# Altium project Main.PrjPcb
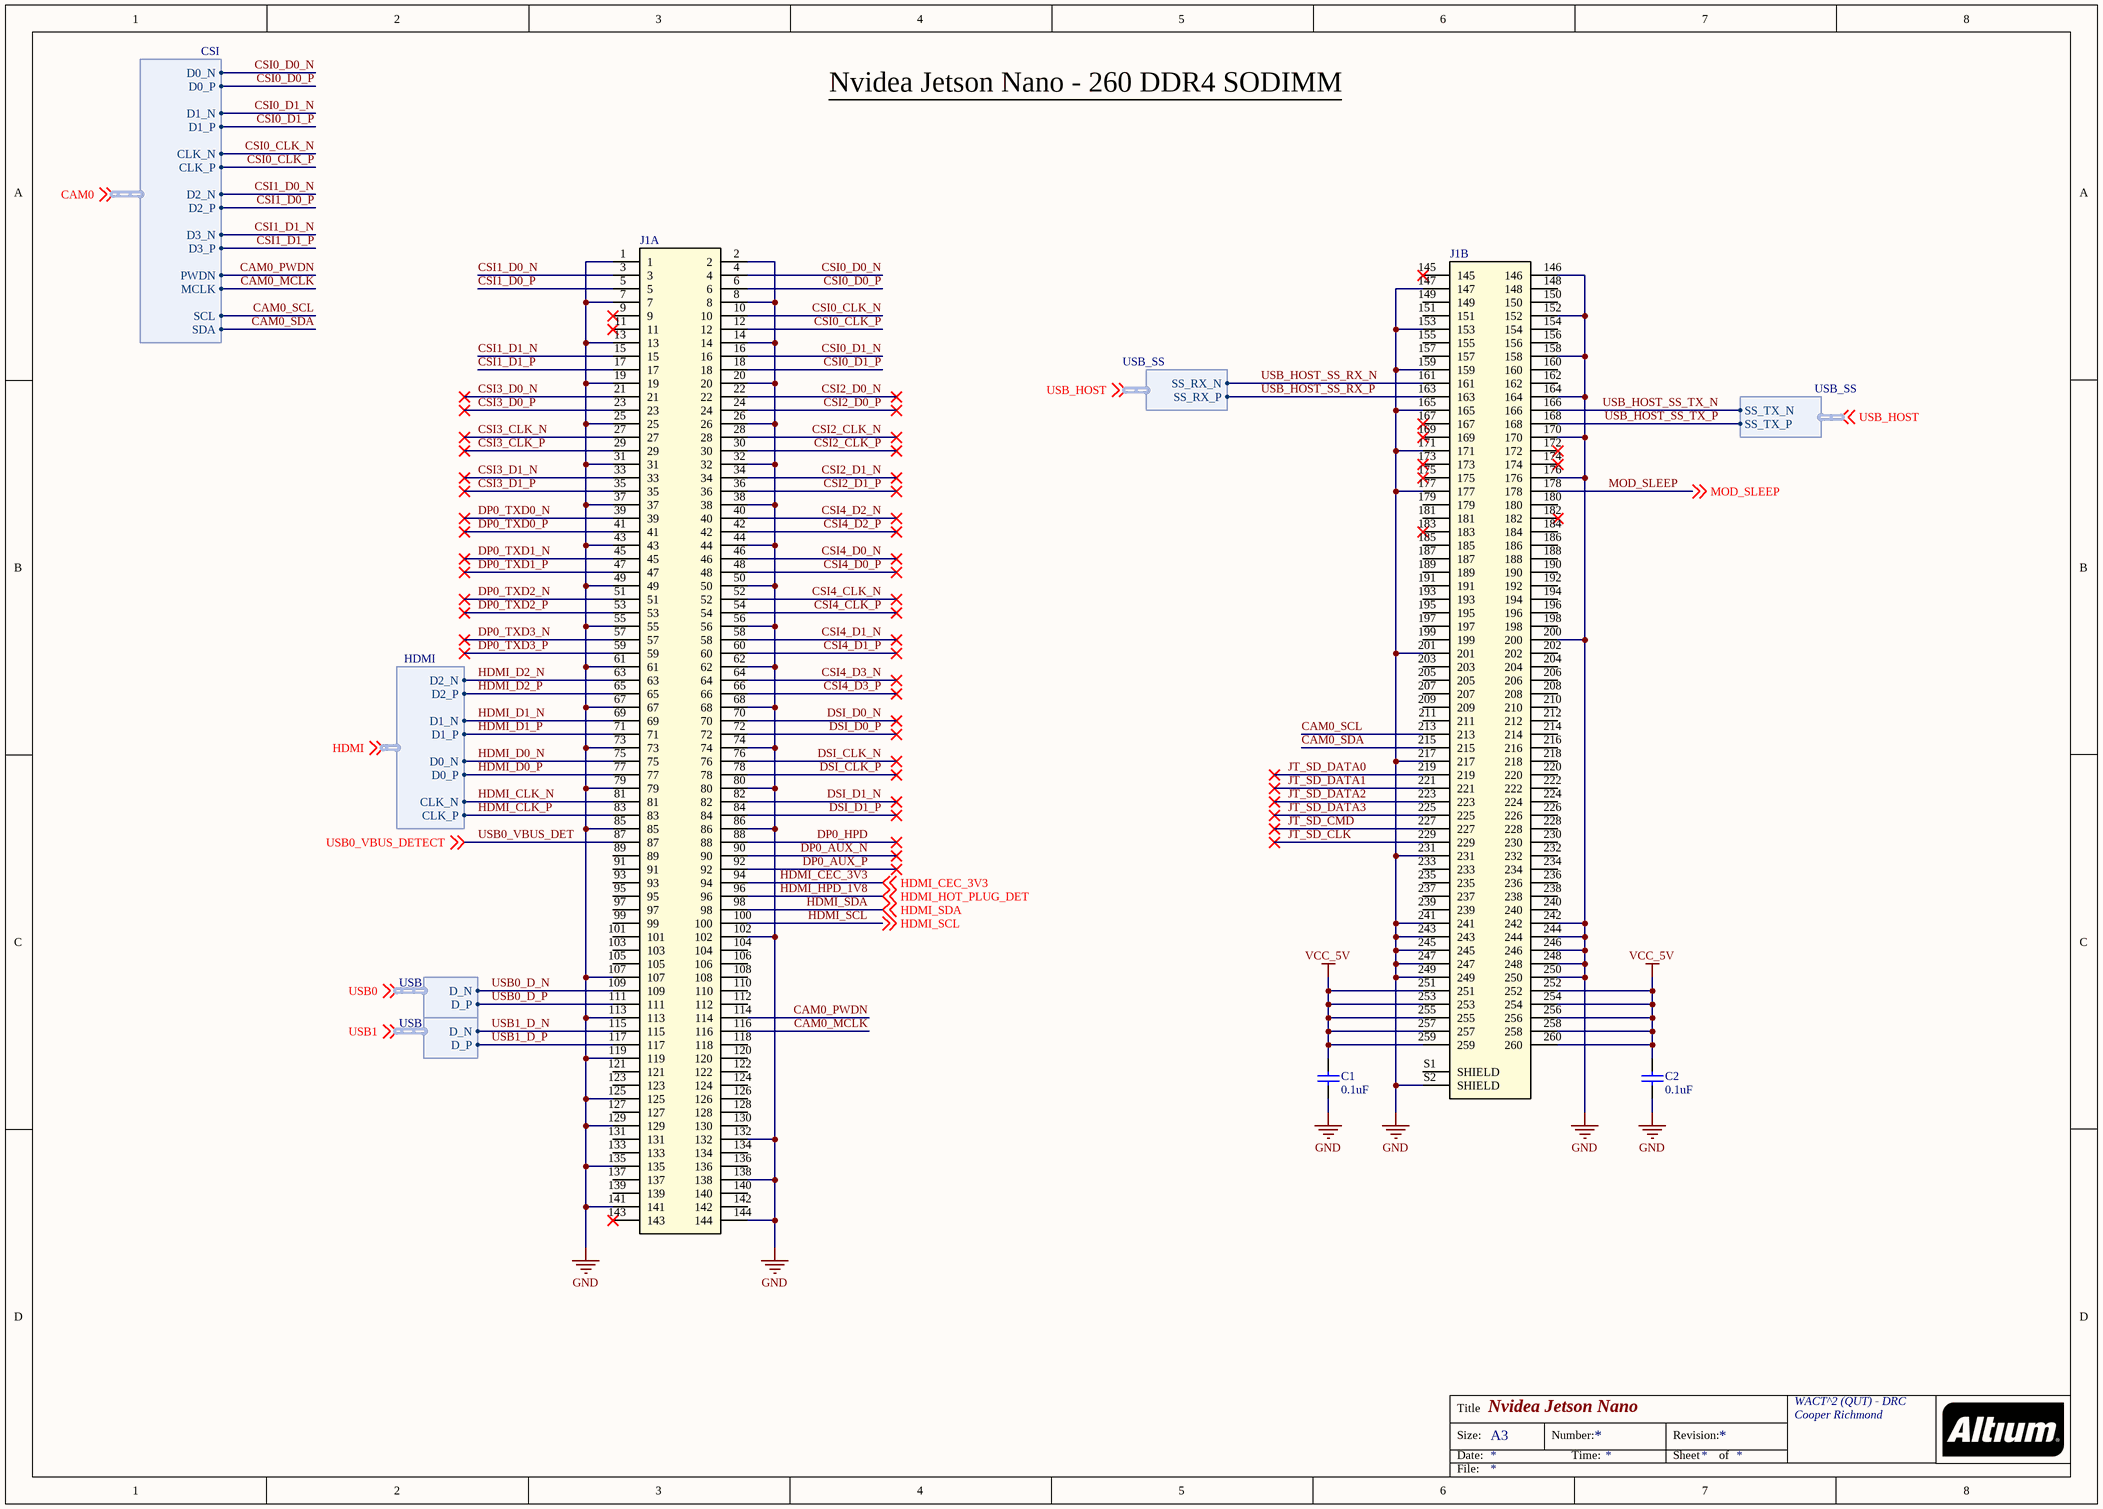
[diagram p0: NvideaJetsonNano.SchDoc]
5 sheets, 165 parts. Net scope: flat (ports and power ports of the same name join across sheets).
Board file: Main.PcbDoc
Sheets:
  NvideaJetsonNano.SchDoc
  NvideaJetsonPeripherals.SchDoc
  PowerSupply.SchDoc
  NvideaJetsonUSB.SchDoc
  NvideaJetsonUSBPage2.SchDoc

## Sheet NvideaJetsonNano.SchDoc: Nvidea Jetson Nano
size A3; Author: Cooper Richmond; DrawnBy: Cooper Richmond; Organization: WACT^2 (QUT) - DRC; Address1: Cooper Richmond

### Parts
C1  value 0.1uF  [C0402]  (hidden comment: CAP)
C2  value 0.1uF  [C0402]  (hidden comment: CAP)
J1  2309411-2  [TE_2309411]  (value not drawn)  (parts A,B of 2)

### Harnesses
USB: D_N, D_P
HDMI: D2_N, D2_P, D1_N, D1_P, D0_N, D0_P, CLK_N, CLK_P
CSI: D0_N, D0_P, D1_N, D1_P, CLK_N, CLK_P, D2_N, D2_P, D3_N, D3_P, PWDN, MCLK, SCL, SDA
USB_SS: SS_RX_P, SS_RX_N
USB_SS: SS_TX_N, SS_TX_P

### Nets
GND: C1.2 C2.2 J1.1 J1.2 J1.7 J1.8 J1.13 J1.14 J1.19 J1.20 J1.25 J1.26 J1.31 J1.32 J1.37 J1.38 J1.43 J1.44 J1.49 J1.50 J1.55 J1.56 J1.61 J1.62 J1.67 J1.68 J1.73 J1.74 J1.79 J1.80 J1.85 J1.86 J1.102 J1.107 J1.113 J1.119 J1.125 J1.129 J1.132 J1.135 J1.138 J1.141 J1.144 J1.146 J1.147 J1.152 J1.153 J1.158 J1.159 J1.164 J1.165 J1.170 J1.171 J1.176 J1.177 J1.200 J1.201 J1.217 J1.231 J1.241 J1.242 J1.243 J1.244 J1.245 J1.246 J1.247 J1.248 J1.249 J1.250 J1.S2(SHIELD)
VCC_5V: C1.1 C2.1 J1.251 J1.252 J1.253 J1.254 J1.255 J1.256 J1.257 J1.258 J1.259 J1.260
CAM0_MCLK: J1.116 ; harness CSI.MCLK
CAM0_PWDN: J1.114 ; harness CSI.PWDN
CAM0_SCL: J1.213 ; harness CSI.SCL
CAM0_SDA: J1.215 ; harness CSI.SDA
CSI0_CLK_N: J1.10 ; harness CSI.CLK_N
CSI0_CLK_P: J1.12 ; harness CSI.CLK_P
CSI0_D0_N: J1.4 ; harness CSI.D0_N
CSI0_D0_P: J1.6 ; harness CSI.D0_P
CSI0_D1_N: J1.16 ; harness CSI.D1_N
CSI0_D1_P: J1.18 ; harness CSI.D1_P
CSI1_D0_N: J1.3 ; harness CSI.D2_N
CSI1_D0_P: J1.5 ; harness CSI.D2_P
CSI1_D1_N: J1.15 ; harness CSI.D3_N
CSI1_D1_P: J1.17 ; harness CSI.D3_P
CSI2_CLK_N: J1.28
CSI2_CLK_P: J1.30
CSI2_D0_N: J1.22
CSI2_D0_P: J1.24
CSI2_D1_N: J1.34
CSI2_D1_P: J1.36
CSI3_CLK_N: J1.27
CSI3_CLK_P: J1.29
CSI3_D0_N: J1.21
CSI3_D0_P: J1.23
CSI3_D1_N: J1.33
CSI3_D1_P: J1.35
CSI4_CLK_N: J1.52
CSI4_CLK_P: J1.54
CSI4_D0_N: J1.46
CSI4_D0_P: J1.48
CSI4_D1_N: J1.58
CSI4_D1_P: J1.60
CSI4_D2_N: J1.40
CSI4_D2_P: J1.42
CSI4_D3_N: J1.64
CSI4_D3_P: J1.66
DP0_AUX_N: J1.90
DP0_AUX_P: J1.92
DP0_HPD: J1.88
DP0_TXD0_N: J1.39
DP0_TXD0_P: J1.41
DP0_TXD1_N: J1.45
DP0_TXD1_P: J1.47
DP0_TXD2_N: J1.51
DP0_TXD2_P: J1.53
DP0_TXD3_N: J1.57
DP0_TXD3_P: J1.59
DSI_CLK_N: J1.76
DSI_CLK_P: J1.78
DSI_D0_N: J1.70
DSI_D0_P: J1.72
DSI_D1_N: J1.82
DSI_D1_P: J1.84
HDMI_CEC_3V3: J1.94 ; off-sheet HDMI_CEC_3V3
HDMI_CLK_N: J1.81 ; harness HDMI.CLK_N
HDMI_CLK_P: J1.83 ; harness HDMI.CLK_P
HDMI_D0_N: J1.75 ; harness HDMI.D0_N
HDMI_D0_P: J1.77 ; harness HDMI.D0_P
HDMI_D1_N: J1.69 ; harness HDMI.D1_N
HDMI_D1_P: J1.71 ; harness HDMI.D1_P
HDMI_D2_N: J1.63 ; harness HDMI.D2_N
HDMI_D2_P: J1.65 ; harness HDMI.D2_P
HDMI_HPD_1V8: J1.96 ; off-sheet HDMI_HOT_PLUG_DET  [also labelled HDMI_HOT_PLUG_DET]
HDMI_SCL: J1.100 ; off-sheet HDMI_SCL
HDMI_SDA: J1.98 ; off-sheet HDMI_SDA
JT_SD_CLK: J1.229
JT_SD_CMD: J1.227
JT_SD_DATA0: J1.219
JT_SD_DATA1: J1.221
JT_SD_DATA2: J1.223
JT_SD_DATA3: J1.225
MOD_SLEEP: J1.178 ; off-sheet MOD_SLEEP
USB0_D_N: J1.109 ; harness USB.D_N
USB0_D_P: J1.111 ; harness USB.D_P
USB0_VBUS_DET: J1.87 ; off-sheet USB0_VBUS_DETECT  [also labelled USB0_VBUS_DETECT]
USB1_D_N: J1.115 ; harness USB.D_N
USB1_D_P: J1.117 ; harness USB.D_P
USB_HOST_SS_RX_N: J1.161 ; harness USB_SS.SS_RX_N
USB_HOST_SS_RX_P: J1.163 ; harness USB_SS.SS_RX_P
USB_HOST_SS_TX_N: J1.166 ; harness USB_SS.SS_TX_N
USB_HOST_SS_TX_P: J1.168 ; harness USB_SS.SS_TX_P

Not connected (* = marked no-connect by the designer): J1 9* 11* 89 91 93 95 97 99 101 103 104 105 106 108 110 112 118 120 121 122 123 124 126 127 128 130 131 133 134 136 137 139 140 142 143* 145* 148 149 150 151 154 155 156 157 160 162 167* 169* 172* 173* 174* 175* 179 180 181 182* 183* 184 185 186 187 188 189 190 191 192 193 194 195 196 197 198 199 202 203 204 205 206 207 208 209 210 211 212 214 216 218 220 222 224 226 228 230 232 233 234 235 236 237 238 239 240 S1(SHIELD)

### Notes on the sheet
- Nvidea Jetson Nano - 260 DDR4 SODIMM
- Labels drawn without touching a wire or pin: CAM0, HDMI, USB0, USB1, USB_HOST
- Title
- Size:
- Date:
- A3
- Number:
- Time:
- Revision:
- Sheet
- of
- File:

### Library data of the parts
C1 C2 = CAP: =Description
J1 = 2309411-2: DDR4 SODIMM 260P 8.0H STD; Centerline_Pitch: .5 mm[.0197 in]; Number_of_Positions: 260; MF: TE Connectivity; Product_Type: Socket; MP: 2309411-2; SnapEDA_Link: https://www.snapeda.com/parts/2309411-2/TE%20Connectivity/view-part/?ref=snap; TE_purchase_URL: https://www.te.com/usa-en/product-2309411-2.html?te_bu=Cor&te_type=disp&te_campaign=seda_glo_cor-seda-global-disp-prtnr-fy19-seda-model-bom-cta_sma-317_1&elqCampaignId=32493; Package: None; EU_RoHS_Compliance: Compliant; Price: None; Value: *

## Sheet NvideaJetsonPeripherals.SchDoc: Nvidea Jetson Peripherals
size A3; Organization: WACT^2 (QUT) - DRC; Address1: Cooper Richmond
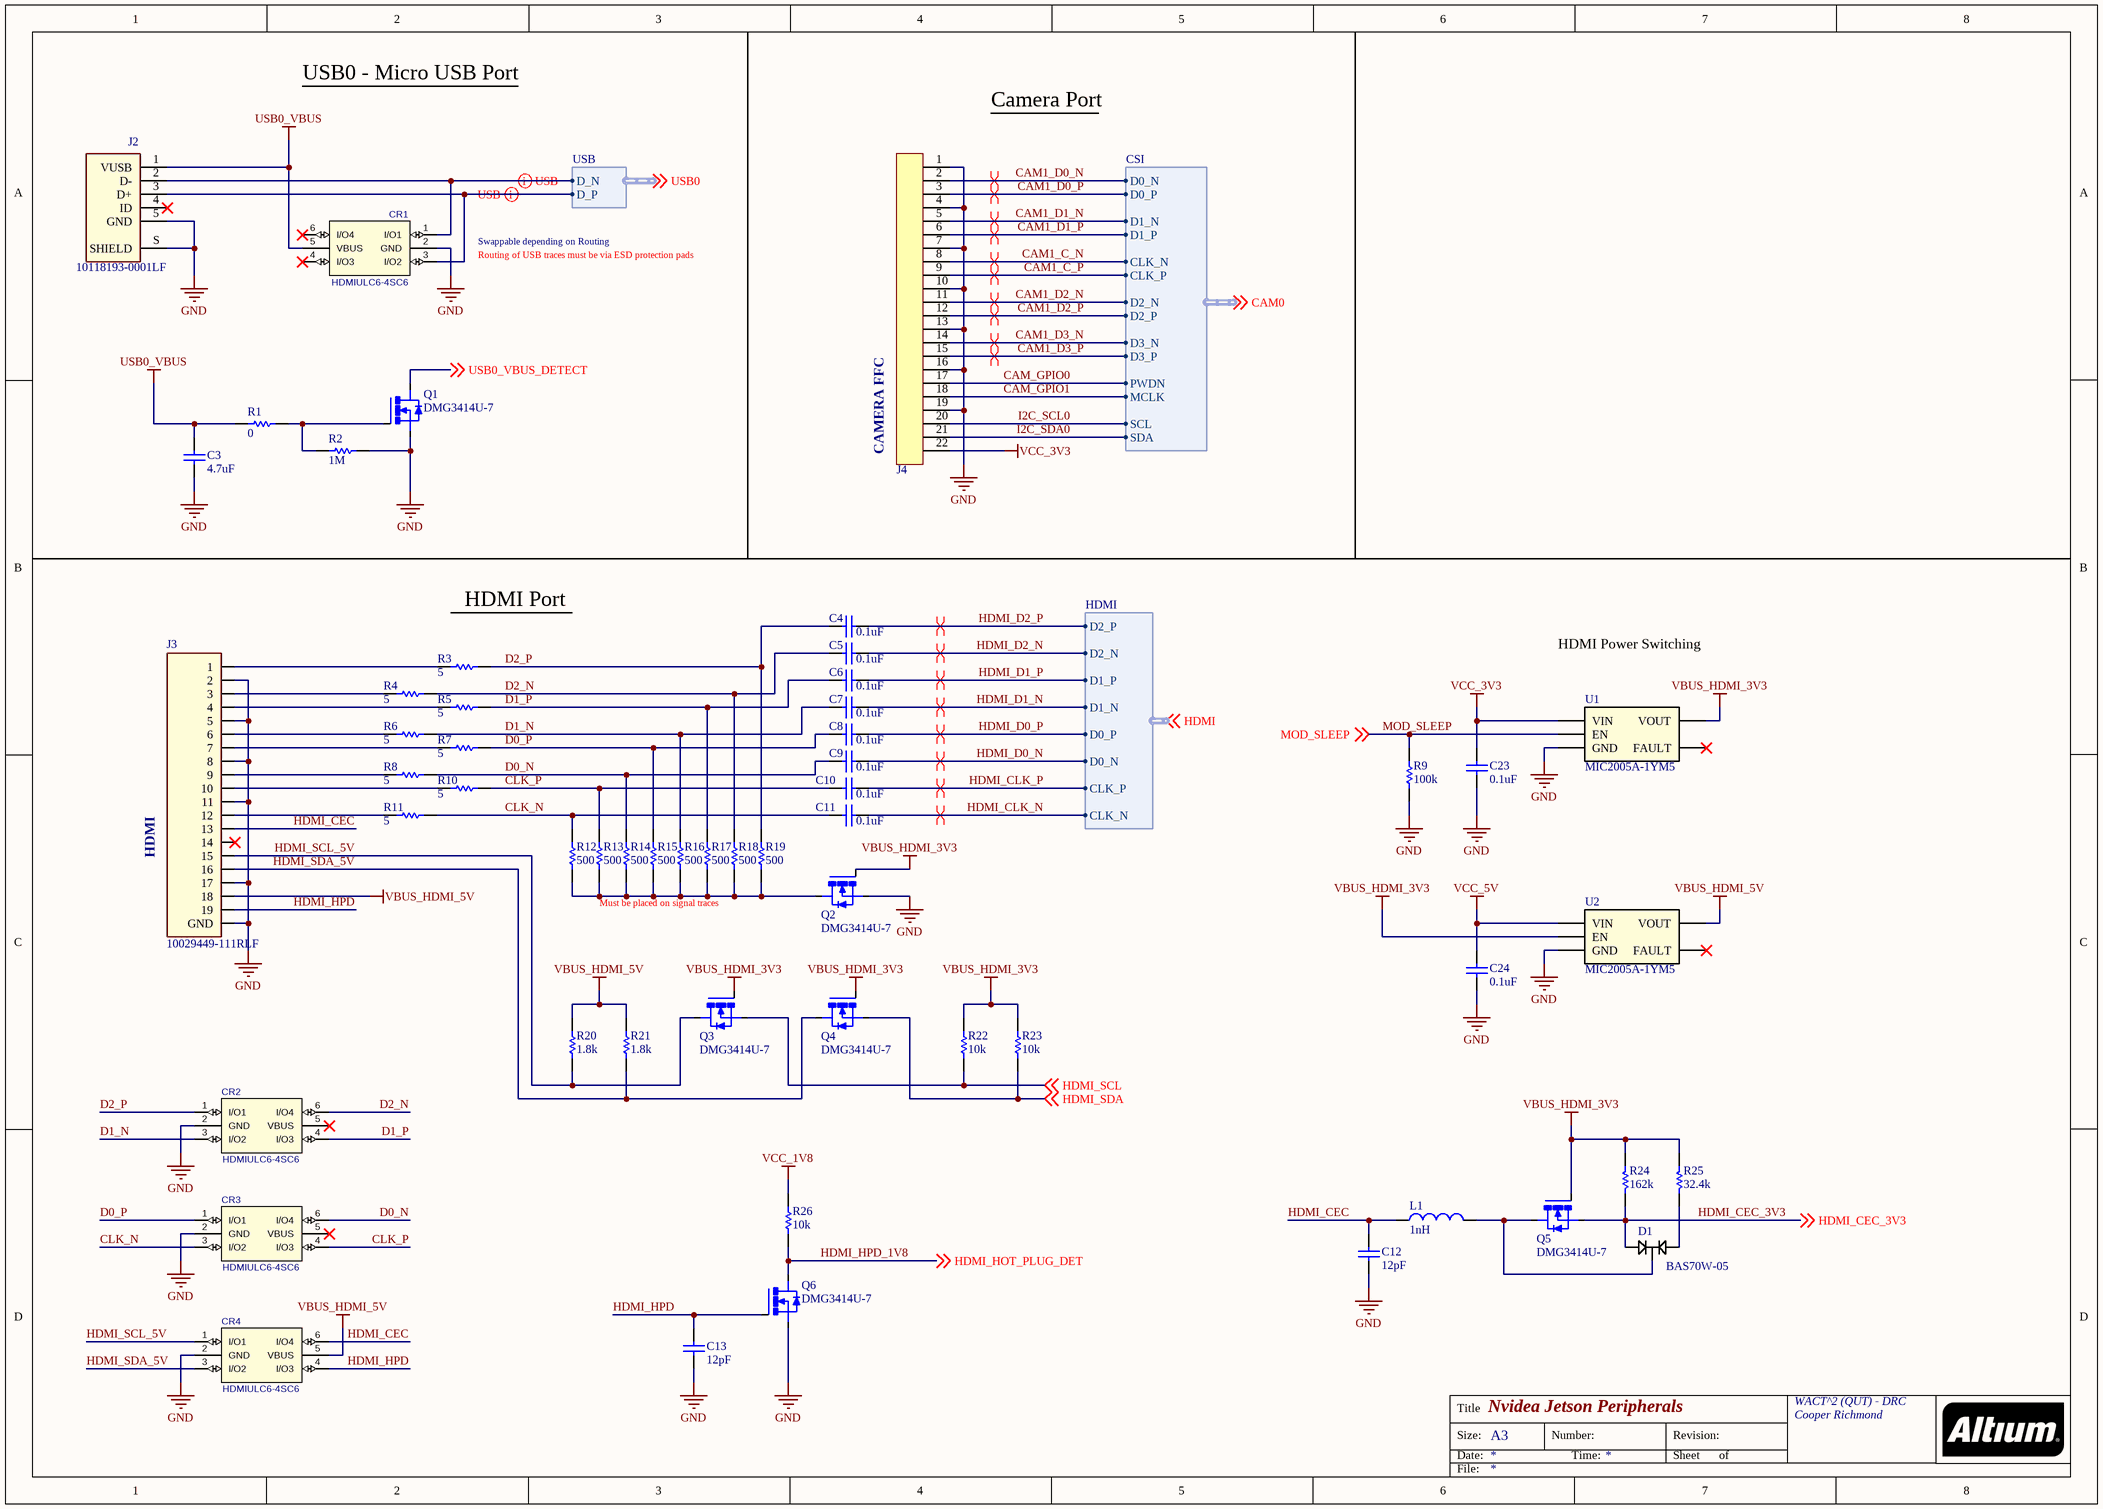
[diagram p1: NvideaJetsonPeripherals.SchDoc]

### Parts
C3  value 4.7uF  [CASE-A]  (hidden comment: CAP)
C4  value 0.1uF  [C0402]  (hidden comment: CAP)
C5  value 0.1uF  [C0402]  (hidden comment: CAP)
C6  value 0.1uF  [C0402]  (hidden comment: CAP)
C7  value 0.1uF  [C0402]  (hidden comment: CAP)
C8  value 0.1uF  [C0402]  (hidden comment: CAP)
C9  value 0.1uF  [C0402]  (hidden comment: CAP)
C10  value 0.1uF  [C0402]  (hidden comment: CAP)
C11  value 0.1uF  [C0402]  (hidden comment: CAP)
C12  value 12pF  [C0402]  (hidden comment: CAP)
C13  value 12pF  [C0402]  (hidden comment: CAP)
C23  value 0.1uF  [C0402]  (hidden comment: CAP)
C24  value 0.1uF  [C0402]  (hidden comment: CAP)
CR1  HDMIULC6-4SC6  [SOT23-6L]
CR2  HDMIULC6-4SC6  [SOT23-6L]
CR3  HDMIULC6-4SC6  [SOT23-6L]
CR4  HDMIULC6-4SC6  [SOT23-6L]
D1  BAS70W-05  [SOT323-3]
J2  10118193-0001LF  [10118193-0001LF]
J3  10029449-111RLF  [10029449-111RLF]
J4  5019512210  [5019512210]  (value not drawn)
L1  value 1nH  [L0402]  (hidden comment: IND)
Q1  DMG3414U-7  [SOT23-3]
Q2  DMG3414U-7  [SOT23-3]
Q3  DMG3414U-7  [SOT23-3]
Q4  DMG3414U-7  [SOT23-3]
Q5  DMG3414U-7  [SOT23-3]
Q6  DMG3414U-7  [SOT23-3]
R1  value 0  [R0402]  (hidden comment: RES)
R2  value 1M  [R0402]  (hidden comment: RES)
R3  value 5  [R0402]  (hidden comment: RES)
R4  value 5  [R0402]  (hidden comment: RES)
R5  value 5  [R0402]  (hidden comment: RES)
R6  value 5  [R0402]  (hidden comment: RES)
R7  value 5  [R0402]  (hidden comment: RES)
R8  value 5  [R0402]  (hidden comment: RES)
R9  value 100k  [R0402]  (hidden comment: RES)
R10  value 5  [R0402]  (hidden comment: RES)
R11  value 5  [R0402]  (hidden comment: RES)
R12  value 500  [R0402]  (hidden comment: RES)
R13  value 500  [R0402]  (hidden comment: RES)
R14  value 500  [R0402]  (hidden comment: RES)
R15  value 500  [R0402]  (hidden comment: RES)
R16  value 500  [R0402]  (hidden comment: RES)
R17  value 500  [R0402]  (hidden comment: RES)
R18  value 500  [R0402]  (hidden comment: RES)
R19  value 500  [R0402]  (hidden comment: RES)
R20  value 1.8k  [R0402]  (hidden comment: RES)
R21  value 1.8k  [R0402]  (hidden comment: RES)
R22  value 10k  [R0402]  (hidden comment: RES)
R23  value 10k  [R0402]  (hidden comment: RES)
R24  value 162k  [R0402]  (hidden comment: RES)
R25  value 32.4k  [R0402]  (hidden comment: RES)
R26  value 10k  [R0402]  (hidden comment: RES)
U1  MIC2005A-1YM5  [SOT23-5]
U2  MIC2005A-1YM5  [SOT23-5]

### Harnesses
USB: D_N, D_P
HDMI: D2_N, D2_P, D1_N, D1_P, D0_N, D0_P, CLK_N, CLK_P
CSI: D0_N, D0_P, D1_N, D1_P, CLK_N, CLK_P, D2_N, D2_P, D3_N, D3_P, PWDN, MCLK, SCL, SDA

### Nets
GND: C3.2 C12.2 C13.2 C23.1 C24.1 CR1.2(GND) CR2.2(GND) CR3.2(GND) CR4.2(GND) J2.5(GND) J2.S(SHIELD) J3.0(GND) J3.2 J3.5 J3.8 J3.11 J3.17 J4.1 J4.4 J4.7 J4.10 J4.13 J4.16 J4.19 Q1.2(S) Q2.2(S) Q6.2(S) R2.1 R9.2 U1.2(GND) U2.2(GND)
USB0_VBUS: C3.1 CR1.5(VBUS) J2.1(VUSB) R1.1
VBUS_HDMI_3V3: Q2.1(G) Q3.1(G) Q4.1(G) Q5.1(G) R22.1 R23.1 R24.1 R25.1 U1.5(VOUT) U2.3(EN)
VBUS_HDMI_5V: CR4.5(VBUS) J3.18 R20.1 R21.1 U2.5(VOUT)
VCC_1V8: R26.1
VCC_3V3: C23.2 J4.22 U1.1(VIN)
VCC_5V: C24.2 U2.1(VIN)
CAM1_C_N: J4.8 ; harness CSI.CLK_N
CAM1_C_P: J4.9 ; harness CSI.CLK_P
CAM1_D0_N: J4.2 ; harness CSI.D0_N
CAM1_D0_P: J4.3 ; harness CSI.D0_P
CAM1_D1_N: J4.5 ; harness CSI.D1_N
CAM1_D1_P: J4.6 ; harness CSI.D1_P
CAM1_D2_N: J4.11 ; harness CSI.D2_N
CAM1_D2_P: J4.12 ; harness CSI.D2_P
CAM1_D3_N: J4.14 ; harness CSI.D3_N
CAM1_D3_P: J4.15 ; harness CSI.D3_P
CAM_GPIO0: J4.17 ; harness CSI.PWDN
CAM_GPIO1: J4.18 ; harness CSI.MCLK
CLK_N: C11.1 CR3.3(I/O2) R11.2 R12.1
CLK_P: C10.1 CR3.4(I/O3) R10.2 R13.1
D0_N: C9.1 CR3.6(I/O4) R8.2 R14.1
D0_P: C8.1 CR3.1(I/O1) R7.2 R15.1
D1_N: C7.1 CR2.3(I/O2) R6.2 R16.1
D1_P: C6.1 CR2.4(I/O3) R5.2 R17.1
D2_N: C5.1 CR2.6(I/O4) R4.2 R18.1
D2_P: C4.1 CR2.1(I/O1) R3.2 R19.1
HDMI_CEC: C12.1 CR4.6(I/O4) J3.13 L1.2
HDMI_CEC_3V3: D1.1 Q5.2(S) R24.2 ; off-sheet HDMI_CEC_3V3
HDMI_CLK_N: C11.2 ; harness HDMI.CLK_N
HDMI_CLK_P: C10.2 ; harness HDMI.CLK_P
HDMI_D0_N: C9.2 ; harness HDMI.D0_N
HDMI_D0_P: C8.2 ; harness HDMI.D0_P
HDMI_D1_N: C7.2 ; harness HDMI.D1_N
HDMI_D1_P: C6.2 ; harness HDMI.D1_P
HDMI_D2_N: C5.2 ; harness HDMI.D2_N
HDMI_D2_P: C4.2 ; harness HDMI.D2_P
HDMI_HPD: C13.1 CR4.4(I/O3) J3.19 Q6.1(G)
HDMI_HPD_1V8: Q6.3(D) R26.2 ; off-sheet HDMI_HOT_PLUG_DET  [also labelled HDMI_HOT_PLUG_DET]
HDMI_SCL: Q3.2(S) R22.2 ; off-sheet HDMI_SCL
HDMI_SCL_5V: CR4.1(I/O1) J3.15 Q3.3(D) R20.2
HDMI_SDA: Q4.2(S) R23.2 ; off-sheet HDMI_SDA
HDMI_SDA_5V: CR4.3(I/O2) J3.16 Q4.3(D) R21.2
I2C_SCL0: J4.20 ; harness CSI.SCL
I2C_SDA0: J4.21 ; harness CSI.SDA
MOD_SLEEP: R9.1 U1.3(EN) ; off-sheet MOD_SLEEP
USB0_VBUS_DETECT: Q1.3(D) ; off-sheet USB0_VBUS_DETECT  [project net USB0_VBUS_DET]
NetCR1_1: CR1.1(I/O1) J2.2(D-) ; harness USB.D_N
NetCR1_3: CR1.3(I/O2) J2.3(D+) ; harness USB.D_P
NetD1_2: D1.2 R25.2
NetD1_3: D1.3 L1.1 Q5.3(D)
NetJ3_1: J3.1 R3.1
NetJ3_3: J3.3 R4.1
NetJ3_4: J3.4 R5.1
NetJ3_6: J3.6 R6.1
NetJ3_7: J3.7 R7.1
NetJ3_9: J3.9 R8.1
NetJ3_10: J3.10 R10.1
NetJ3_12: J3.12 R11.1
NetQ1_1: Q1.1(G) R1.2 R2.2
NetQ2_3: Q2.3(D) R12.2 R13.2 R14.2 R15.2 R16.2 R17.2 R18.2 R19.2

Not connected (* = marked no-connect by the designer): CR1 4(I/O3)* 6(I/O4)*; CR2 5(VBUS)*; CR3 5(VBUS)*; J2 4(ID)*; J3 14*; U1 4(FAULT)*; U2 4(FAULT)*

### Layout directives
differential pair; differential pair class DIFF: NetCR1_1, NetCR1_3
differential pair; differential pair class DIFF; net class HDMI: HDMI_CLK_N, HDMI_CLK_P, HDMI_D0_N, HDMI_D0_P, HDMI_D1_N, HDMI_D1_P, HDMI_D2_N, HDMI_D2_P
differential pair; differential pair class DIFF; net class CSI: CAM1_C_N, CAM1_C_P, CAM1_D0_N, CAM1_D0_P, CAM1_D1_N, CAM1_D1_P, CAM1_D2_N, CAM1_D2_P, CAM1_D3_N, CAM1_D3_P

### Notes on the sheet
- USB0 - Micro USB Port
- Camera Port
- Swappable depending on Routing
- Routing of USB traces must be via ESD protection pads
- (near J4) CAMERA FFC
- HDMI Port
- HDMI Power Switching
- HDMI
- Must be placed on signal traces
- Labels drawn without touching a wire or pin: CAM0, HDMI, USB0
- Title
- Size:
- Date:
- A3
- Number:
- Time:
- Revision:
- Sheet
- of
- File:

### Library data of the parts
C3-C13 C23 C24 = CAP: =Description
CR1-CR4 = HDMIULC6-4SC6: C: Copyright (C) 2015 Accelerated Designs. All rights reserved; Vendor: STMicroelectronics; Built_By: EMA_UL_Team; Value: HDMIULC6-4SC6
  CR1: Manufacturer_Part_Number: HDMIULC6-4SC6
  CR2-CR4: Part_Number: HDMIULC6-4SC6
D1 = BAS70W-05: SURFACE MOUNT SCHOTTKY BARRIER DIODE; Manufacturers Part No: BAS70W-05
J2 = 10118193-0001LF: Single Port 5 Contact Shielded SMT MICRO USB B-Type Receptacle; MF: Amphenol ICC; Package: None; Digi-Key_Part_Number: 609-4616-1-ND; MP: 10118193-0001LF; Digi-Key_Purchase_URL: https://www.digikey.com.au/product-detail/en/amphenol-icc-fci/10118193-0001LF/609-4616-1-ND/2785380?utm_source=snapeda&utm_medium=aggregator&utm_campaign=symbol; SnapEDA_Link: https://www.snapeda.com/parts/10118193-0001LF/Amphenol%20ICC/view-part/?ref=snap; Value: *
J3 = 10029449-111RLF: CONN RCPT 1.4 HDMI 19POS R/A; Part_Number: 10029449-111RLF
J4 = HDR_1x22: FFC 22 POS VERT; Part_Number: 5019512210
L1 = IND: =Description
Q1-Q4 = MOSFET_N_GSD: =Description; Manufacturer Part No: DMG3414U-7
Q5 Q6 = MOSFET_N_GSD: N Channel MOSFET, SOT23; Part_Number: DMG3414U-7
R1-R26 = RES: =Description
U1 U2 = MIC2005A-1YM5: Power Switch/Driver 1:1 P-Channel 500mA SOT-23-5; Manufacturer Part No: MIC2005A-1YM5

## Sheet PowerSupply.SchDoc
size A3; Organization: Altium Limited; Address1: L3, 12a Rodborough Rd; Address2: Frenchs Forest; Address3: NSW; Address4: Australia 2086
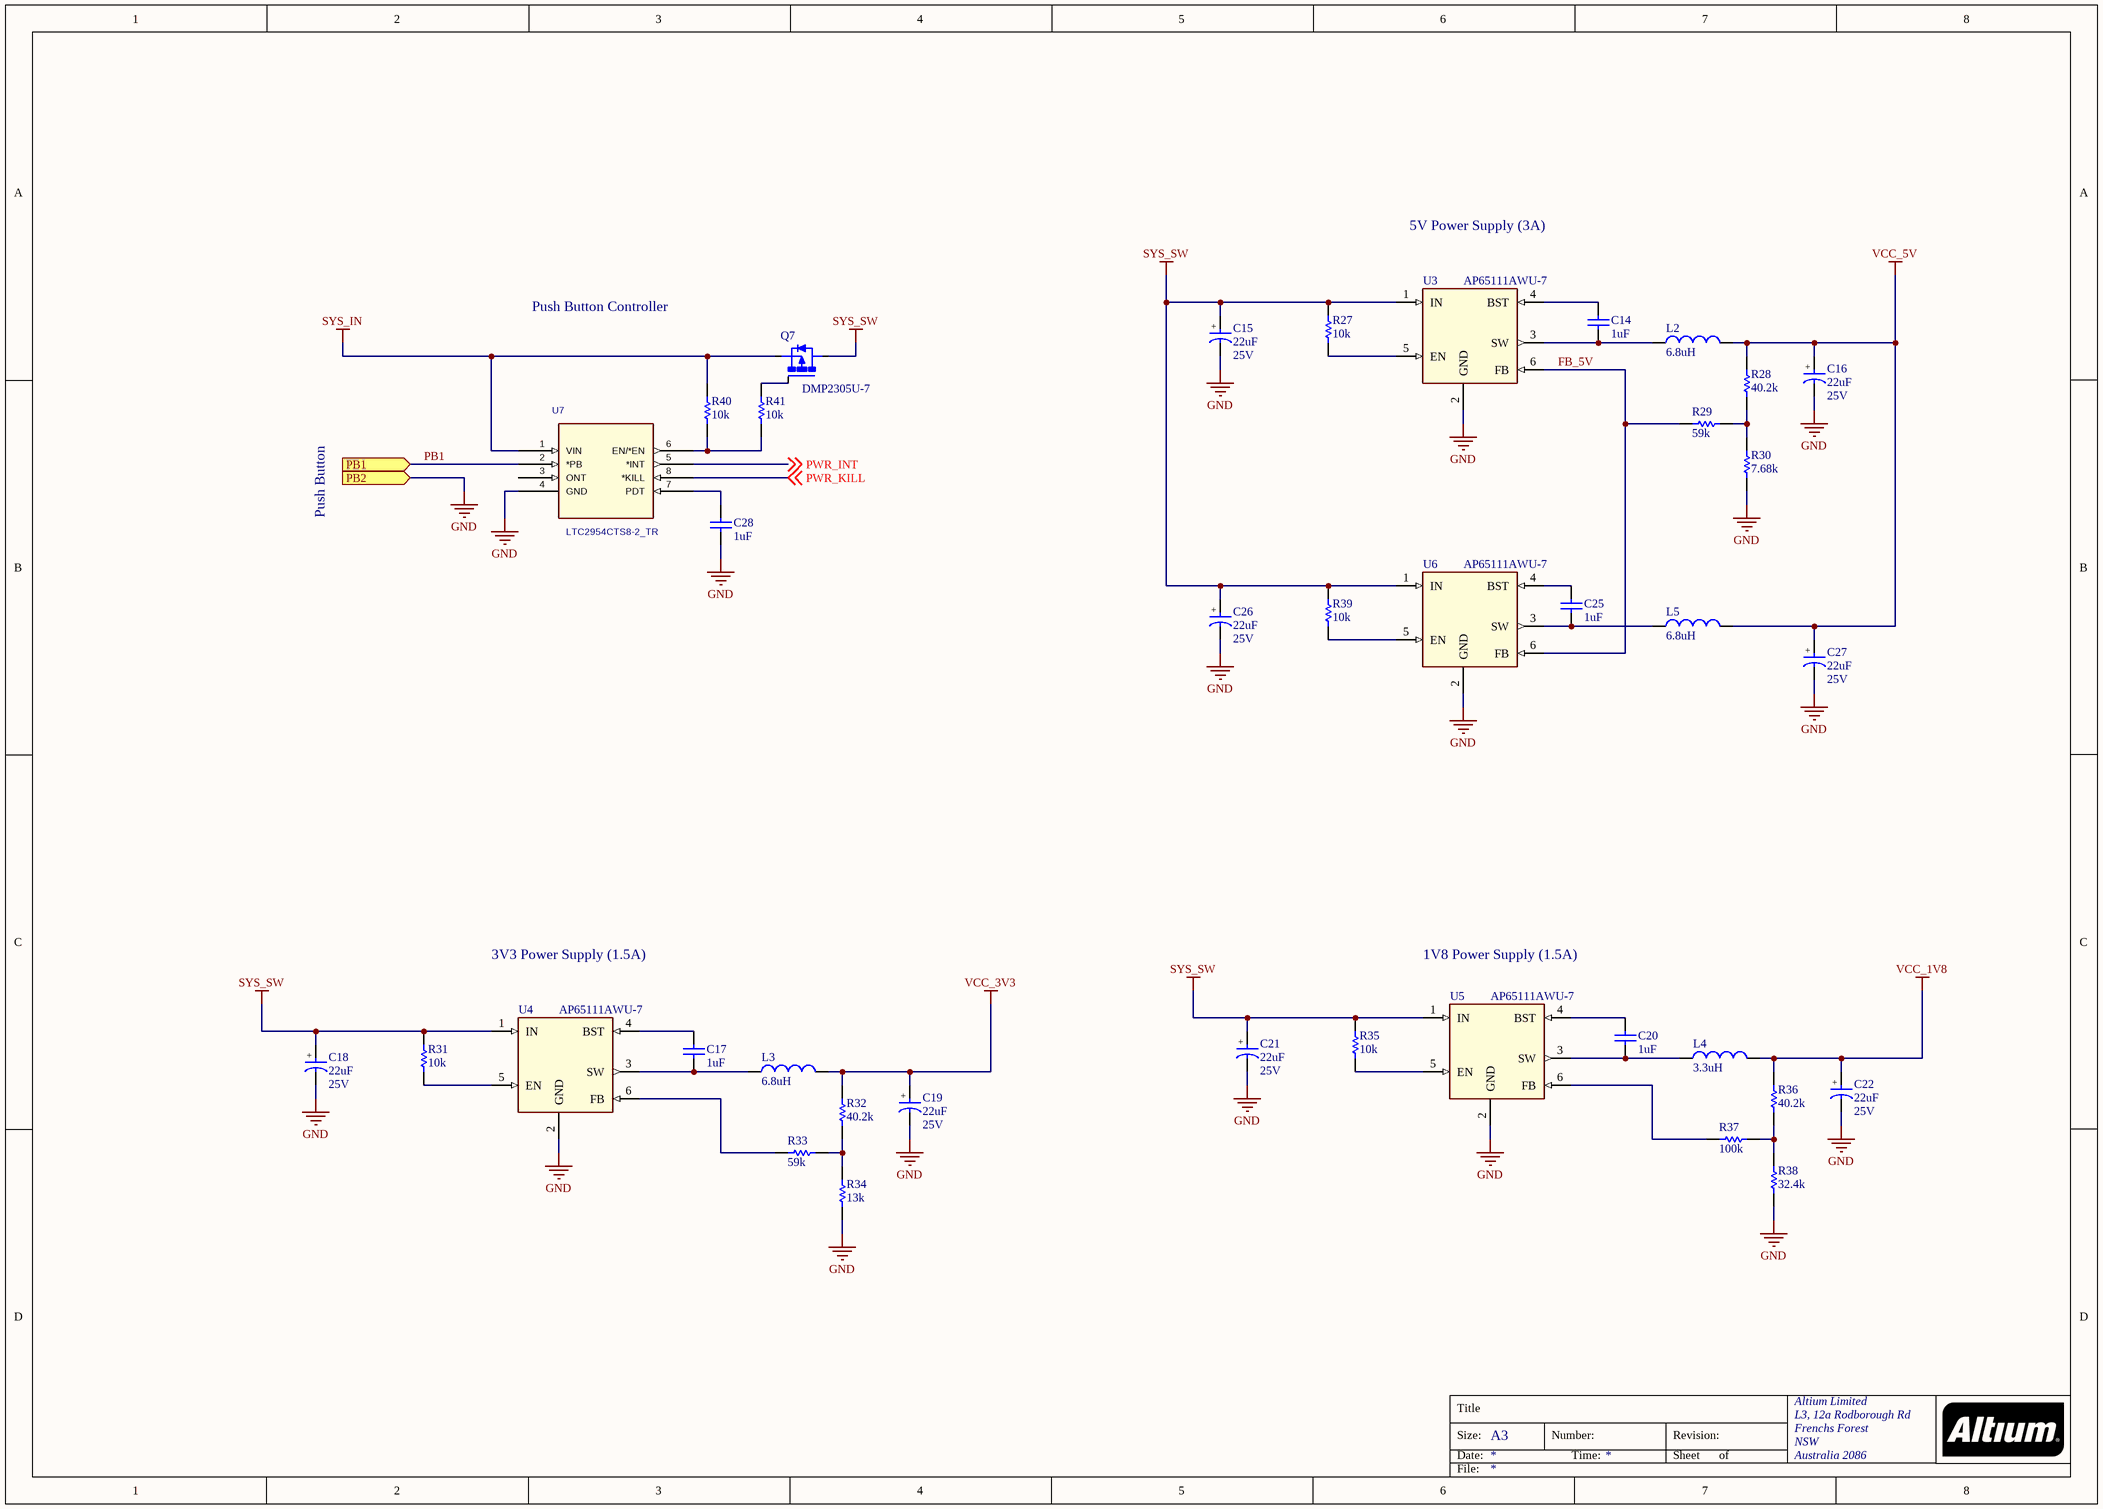
[diagram p2: PowerSupply.SchDoc]

### Parts
C14  value 1uF  [C0603]  (hidden comment: CAP)
C15  value 22uF  Voltage: 25V  [CASE-A]  (hidden comment: CAP-P)
C16  value 22uF  Voltage: 25V  [CASE-A]  (hidden comment: CAP-P)
C17  value 1uF  [C0603]  (hidden comment: CAP)
C18  value 22uF  Voltage: 25V  [CASE-A]  (hidden comment: CAP-P)
C19  value 22uF  Voltage: 25V  [CASE-A]  (hidden comment: CAP-P)
C20  value 1uF  [C0603]  (hidden comment: CAP)
C21  value 22uF  Voltage: 25V  [CASE-A]  (hidden comment: CAP-P)
C22  value 22uF  Voltage: 25V  [CASE-A]  (hidden comment: CAP-P)
C25  value 1uF  [C0603]  (hidden comment: CAP)
C26  value 22uF  Voltage: 25V  [CASE-A]  (hidden comment: CAP-P)
C27  value 22uF  Voltage: 25V  [CASE-A]  (hidden comment: CAP-P)
C28  value 1uF  [C0402]  (hidden comment: CAP)
L2  value 6.8uH  [PA4332.XXXNLT]  (hidden comment: PA4332.103NLT)
L3  value 6.8uH  [PA4332.XXXNLT]  (hidden comment: PA4332.103NLT)
L4  value 3.3uH  [PA4332.XXXNLT]  (hidden comment: PA4332.103NLT)
L5  value 6.8uH  [PA4332.XXXNLT]  (hidden comment: PA4332.103NLT)
Q7  DMP2305U-7  [SOT23-3]
R27  value 10k  [R0402]  (hidden comment: RES)
R28  value 40.2k  [R0402]  (hidden comment: RES)
R29  value 59k  [R0402]  (hidden comment: RES)
R30  value 7.68k  [R0402]  (hidden comment: RES)
R31  value 10k  [R0402]  (hidden comment: RES)
R32  value 40.2k  [R0402]  (hidden comment: RES)
R33  value 59k  [R0402]  (hidden comment: RES)
R34  value 13k  [R0402]  (hidden comment: RES)
R35  value 10k  [R0402]  (hidden comment: RES)
R36  value 40.2k  [R0402]  (hidden comment: RES)
R37  value 100k  [R0402]  (hidden comment: RES)
R38  value 32.4k  [R0402]  (hidden comment: RES)
R39  value 10k  [R0402]  (hidden comment: RES)
R40  value 10k  [R0402]  (hidden comment: RES)
R41  value 10k  [R0402]  (hidden comment: RES)
U3  AP65111AWU-7  [SOT95P280X100-6N]
U4  AP65111AWU-7  [SOT95P280X100-6N]
U5  AP65111AWU-7  [SOT95P280X100-6N]
U6  AP65111AWU-7  [SOT95P280X100-6N]
U7  LTC2954CTS8-2_TR  [TSOT-23_TS8-M]

### Ports
PB1 (in), PB2 (in)

### Nets
GND: C15.2 C16.2 C18.2 C19.2 C21.2 C22.2 C26.2 C27.2 C28.2 R30.2 R34.2 R38.2 U3.2(GND) U4.2(GND) U5.2(GND) U6.2(GND) U7.4(GND) ; port PB2
SYS_IN: Q7.2(S) R40.2 U7.1(VIN)
SYS_SW: C15.1 C18.1 C21.1 C26.1 Q7.3(D) R27.1 R31.1 R35.1 R39.1 U3.1(IN) U4.1(IN) U5.1(IN) U6.1(IN)
VCC_1V8: C22.1 L4.2 R36.1
VCC_3V3: C19.1 L3.2 R32.1
VCC_5V: C16.1 C27.1 L2.2 L5.2 R28.1
FB_5V: R29.1 U3.6(FB) U6.6(FB)
PB1: U7.2(*PB) ; port PB1
PWR_INT: U7.5(*INT) ; off-sheet PWR_INT
PWR_KILL: U7.8(*KILL) ; off-sheet PWR_KILL
NetC14_1: C14.1 U3.4(BST)
NetC14_2: C14.2 L2.1 U3.3(SW)
NetC17_1: C17.1 U4.4(BST)
NetC17_2: C17.2 L3.1 U4.3(SW)
NetC20_1: C20.1 U5.4(BST)
NetC20_2: C20.2 L4.1 U5.3(SW)
NetC25_1: C25.1 U6.4(BST)
NetC25_2: C25.2 L5.1 U6.3(SW)
NetC28_1: C28.1 U7.7(PDT)
NetQ7_1: Q7.1(G) R41.2
NetR27_2: R27.2 U3.5(EN)
NetR28_2: R28.2 R29.2 R30.1
NetR31_2: R31.2 U4.5(EN)
NetR32_2: R32.2 R33.2 R34.1
NetR33_1: R33.1 U4.6(FB)
NetR35_2: R35.2 U5.5(EN)
NetR36_2: R36.2 R37.2 R38.1
NetR37_1: R37.1 U5.6(FB)
NetR39_2: R39.2 U6.5(EN)
NetR40_1: R40.1 R41.1 U7.6(EN/*EN)

Not connected (* = marked no-connect by the designer): U7 3(ONT)

### Notes on the sheet
- 5V Power Supply (3A)
- Push Button Controller
- Push Button
- 3V3 Power Supply (1.5A)
- 1V8 Power Supply (1.5A)
- Title
- Size:
- Date:
- A3
- Number:
- Time:
- Revision:
- Sheet
- of
- File:
- (in symbol CAP-P) +

### Library data of the parts
C14 C17 C20 C25 C28 = CAP: =Description; Voltage: 25V
C15 C16 C18 C19 C21 C22 C26 C27 = CAP-P: =Description
L2 L3 L5 = IND: =Description; Part_Number: PA4332.682NLT
L4 = IND: FIXED IND 10UH 2A 216 MOHM SMD; Part_Number: PA4332.332NLT
Q7 = MOSFET_P_GSD: P Channel MOSFET, SOT23; Part_Number: DMP2305U-7
R27-R41 = RES: =Description
U3-U6 = AP65111AWU-7: Dcdc Conv Hv Buck Tsot26 t&r 3k; MF: Diodes Inc.; Digi-Key_Purchase_URL: https://www.digikey.com.au/product-detail/en/diodes-incorporated/AP65111AWU-7/AP65111AWU-7DICT-ND/7652826?utm_source=snapeda&utm_medium=aggregator&utm_campaign=symbol; MP: AP65111AWU-7; Package: TSOT-23-6 Diodes Inc.; SnapEDA_Link: https://www.snapeda.com/parts/AP65111AWU-7/Diodes%20Inc./view-part/?ref=snap; Digi-Key_Part_Number: AP65111AWU-7DICT-ND; Value: *; Part_Number: AP65111AWU-7
U7 = LTC2954CTS8-2_TR: Part_Number: LTC2954CTS8-2#TRMPBF; Vendor: Linear Technology; Built_By: EMA_UL_Team; Value: LTC2954CTS8-2_TR

## Sheet NvideaJetsonUSB.SchDoc
size A3
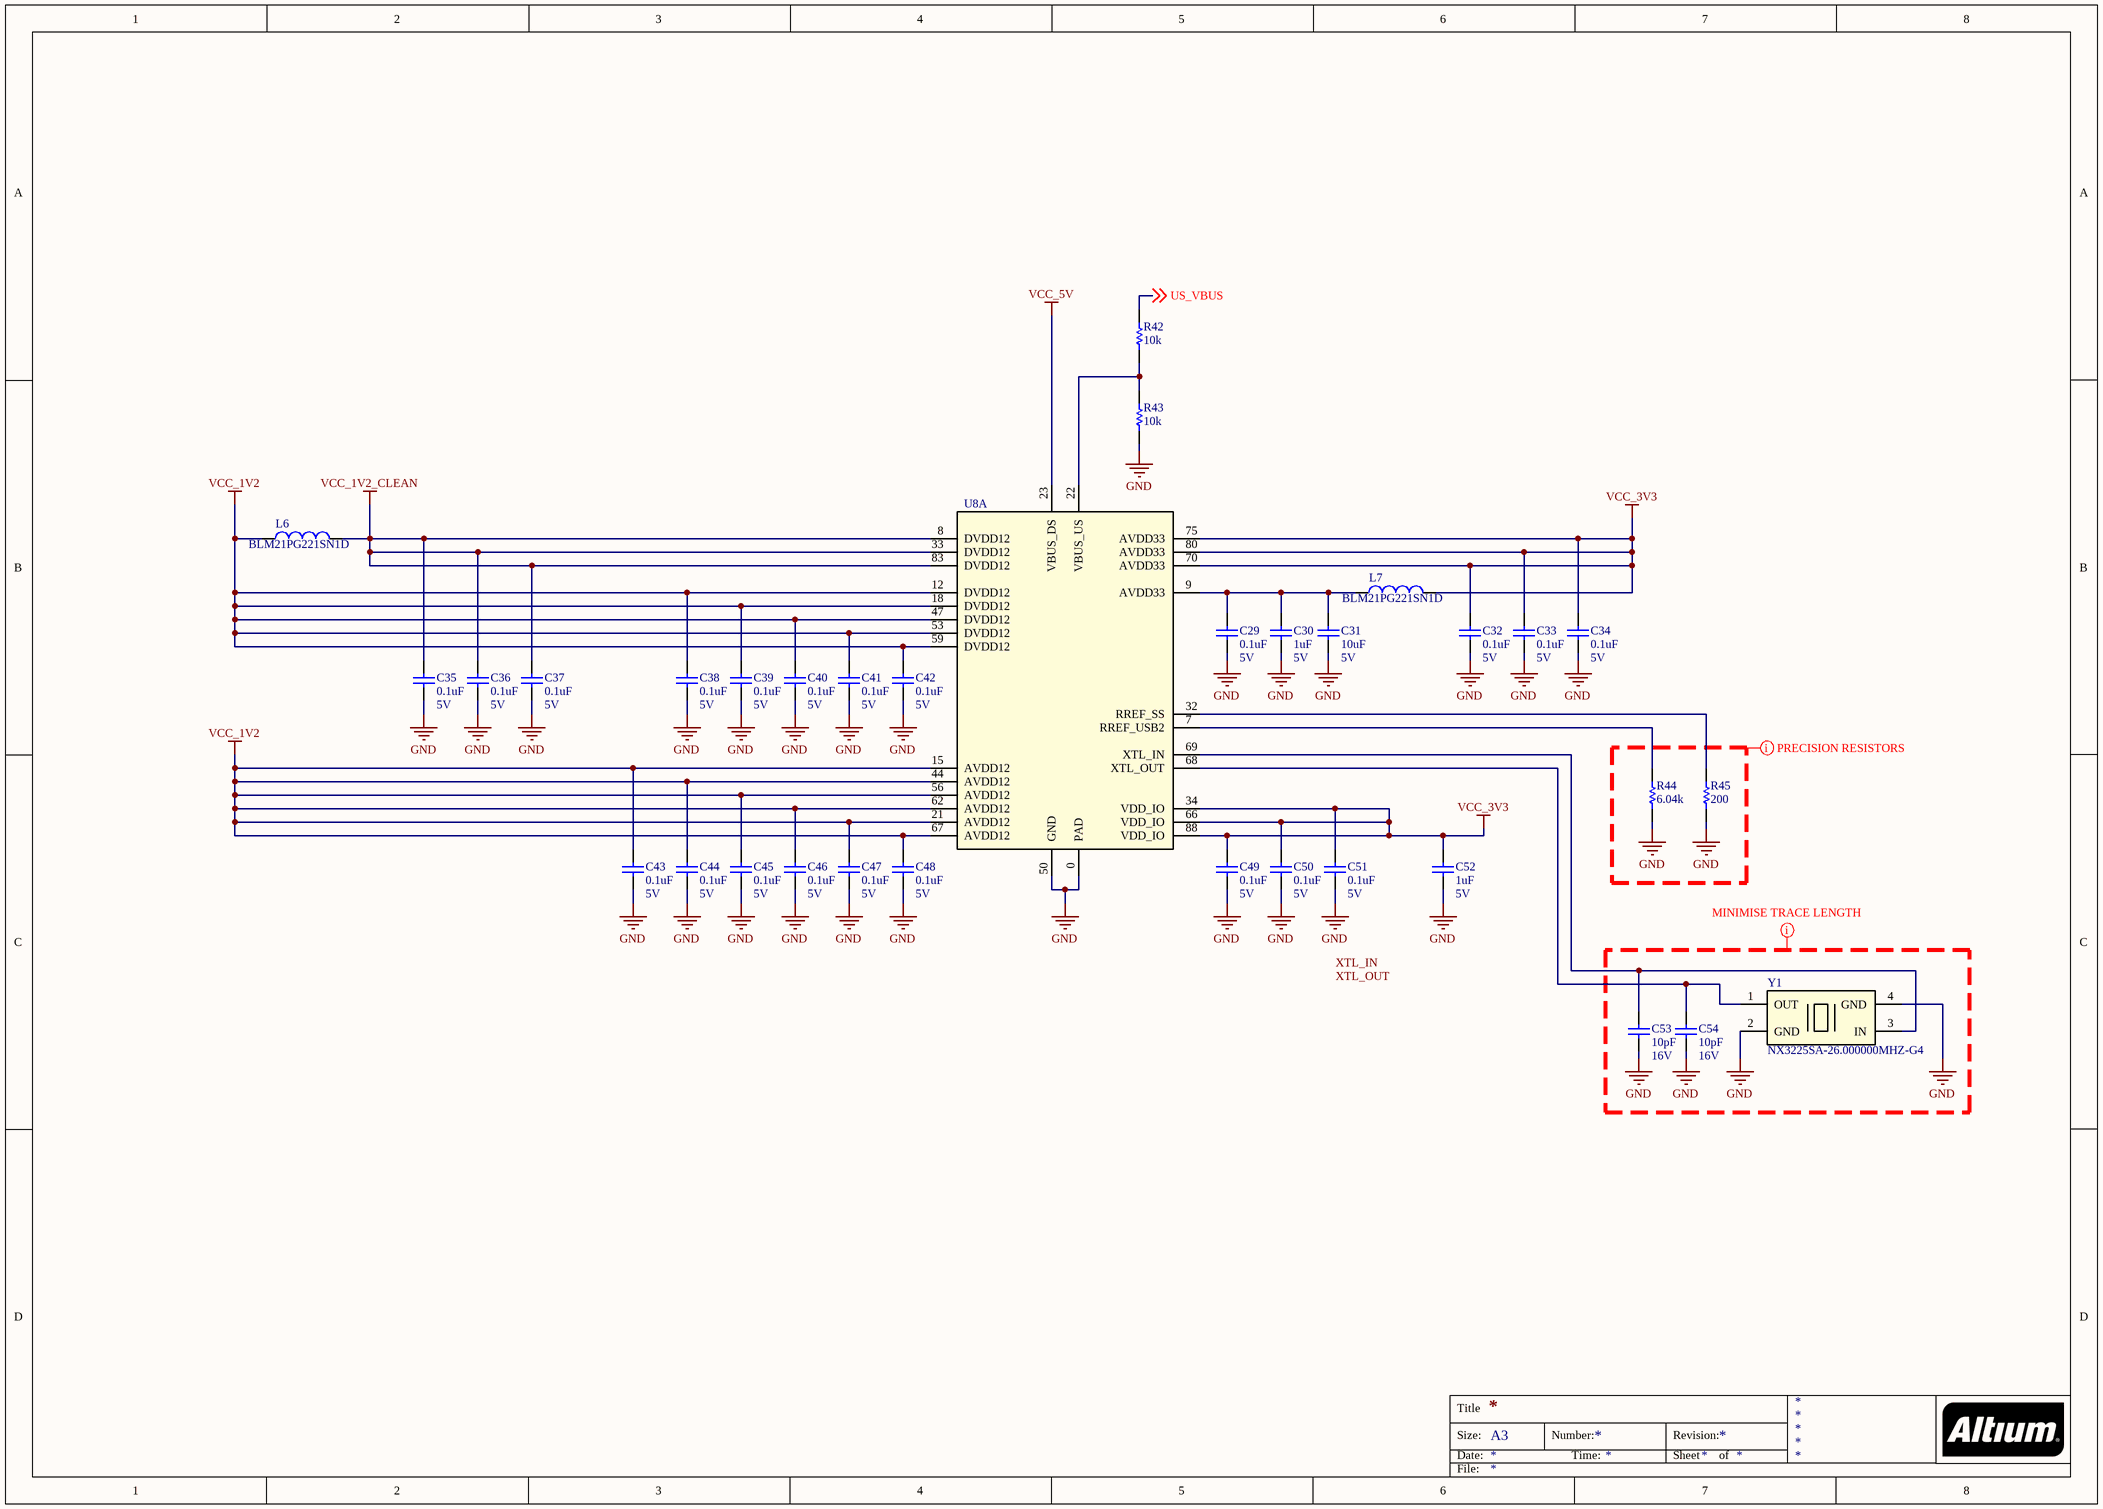
[diagram p3: NvideaJetsonUSB.SchDoc]

### Parts
C29  value 0.1uF  Voltage: 5V  [C0402]  (hidden comment: CAP)
C30  value 1uF  Voltage: 5V  [C0402]  (hidden comment: CAP)
C31  value 10uF  Voltage: 5V  [C0603]  (hidden comment: CAP)
C32  value 0.1uF  Voltage: 5V  [C0402]  (hidden comment: CAP)
C33  value 0.1uF  Voltage: 5V  [C0402]  (hidden comment: CAP)
C34  value 0.1uF  Voltage: 5V  [C0402]  (hidden comment: CAP)
C35  value 0.1uF  Voltage: 5V  [C0402]  (hidden comment: CAP)
C36  value 0.1uF  Voltage: 5V  [C0402]  (hidden comment: CAP)
C37  value 0.1uF  Voltage: 5V  [C0402]  (hidden comment: CAP)
C38  value 0.1uF  Voltage: 5V  [C0402]  (hidden comment: CAP)
C39  value 0.1uF  Voltage: 5V  [C0402]  (hidden comment: CAP)
C40  value 0.1uF  Voltage: 5V  [C0402]  (hidden comment: CAP)
C41  value 0.1uF  Voltage: 5V  [C0402]  (hidden comment: CAP)
C42  value 0.1uF  Voltage: 5V  [C0402]  (hidden comment: CAP)
C43  value 0.1uF  Voltage: 5V  [C0402]  (hidden comment: CAP)
C44  value 0.1uF  Voltage: 5V  [C0402]  (hidden comment: CAP)
C45  value 0.1uF  Voltage: 5V  [C0402]  (hidden comment: CAP)
C46  value 0.1uF  Voltage: 5V  [C0402]  (hidden comment: CAP)
C47  value 0.1uF  Voltage: 5V  [C0402]  (hidden comment: CAP)
C48  value 0.1uF  Voltage: 5V  [C0402]  (hidden comment: CAP)
C49  value 0.1uF  Voltage: 5V  [C0402]  (hidden comment: CAP)
C50  value 0.1uF  Voltage: 5V  [C0402]  (hidden comment: CAP)
C51  value 0.1uF  Voltage: 5V  [C0402]  (hidden comment: CAP)
C52  value 1uF  Voltage: 5V  [C0402]  (hidden comment: CAP)
C53  value 10pF  Voltage: 16V  [C0402]  (hidden comment: CAP)
C54  value 10pF  Voltage: 16V  [C0402]  (hidden comment: CAP)
L6  value BLM21PG221SN1D  [L0603]  (hidden comment: IND)
L7  value BLM21PG221SN1D  [L0603]  (hidden comment: IND)
R42  value 10k  [R0402]  (hidden comment: RES)
R43  value 10k  [R0402]  (hidden comment: RES)
R44  value 6.04k  [R0402]  (hidden comment: RES)
R45  value 200  [R0402]  (hidden comment: RES)
U8  CYUSB3312-88LTXC  [QFN88]  (value not drawn)  (part A of 2)
Y1  CRYSTAL  [NX3225SA-26.000000MHZ-G4]  (value not drawn)

### Nets
GND: C29.2 C30.2 C31.2 C32.2 C33.2 C34.2 C35.2 C36.2 C37.2 C38.2 C39.2 C40.2 C41.2 C42.2 C43.2 C44.2 C45.2 C46.2 C47.2 C48.2 C49.2 C50.2 C51.2 C52.2 C53.2 C54.2 R43.2 R44.2 R45.1 U8.0(PAD) U8.50(GND) Y1.2(GND) Y1.4(GND)
VCC_1V2: C38.1 C39.1 C40.1 C41.1 C42.1 C43.1 C44.1 C45.1 C46.1 C47.1 C48.1 L6.1 U8.12(DVDD12) U8.15(AVDD12) U8.18(DVDD12) U8.21(AVDD12) U8.44(AVDD12) U8.47(DVDD12) U8.53(DVDD12) U8.56(AVDD12) U8.59(DVDD12) U8.62(AVDD12) U8.67(AVDD12)
VCC_1V2_CLEAN: C35.1 C36.1 C37.1 L6.2 U8.8(DVDD12) U8.33(DVDD12) U8.83(DVDD12)
VCC_3V3: C32.1 C33.1 C34.1 C49.1 C50.1 C51.1 C52.1 L7.2 U8.34(VDD_IO) U8.66(VDD_IO) U8.70(AVDD33) U8.75(AVDD33) U8.80(AVDD33) U8.88(VDD_IO)
VCC_5V: U8.23(VBUS_DS)
US_VBUS: R42.1 ; off-sheet US_VBUS
NetC29_1: C29.1 C30.1 C31.1 L7.1 U8.9(AVDD33)
NetC53_1: C53.1 U8.69(XTL_IN) Y1.3(IN)
NetC54_1: C54.1 U8.68(XTL_OUT) Y1.1(OUT)
NetR42_2: R42.2 R43.1 U8.22(VBUS_US)
NetR44_1: R44.1 U8.7(RREF_USB2)
NetR45_2: R45.2 U8.32(RREF_SS)

### Layout directives
mark named MINIMISE TRACE LENGTH: (no net found under the mark)
mark named PRECISION RESISTORS: (no net found under the mark)

### Notes on the sheet
- Labels drawn without touching a wire or pin: XTL_IN, XTL_OUT
- Title
- Size:
- Date:
- A3
- Number:
- Time:
- Revision:
- Sheet
- of
- File:

### Library data of the parts
C29-C54 = CAP: =Description
L6 L7 = IND: BLM21PG221SN1D Ferrite Bead
R42-R45 = RES: =Description
U8 = CYUSB3312-88LTXC: USB3.0 Hub; Centerline_Pitch: .5 mm[.0197 in]; MP: 2309411-2; Number_of_Positions: 260; MF: TE Connectivity; Product_Type: Socket; SnapEDA_Link: https://www.snapeda.com/parts/2309411-2/TE%20Connectivity/view-part/?ref=snap; TE_purchase_URL: https://www.te.com/usa-en/product-2309411-2.html?te_bu=Cor&te_type=disp&te_campaign=seda_glo_cor-seda-global-disp-prtnr-fy19-seda-model-bom-cta_sma-317_1&elqCampaignId=32493; Package: None; EU_RoHS_Compliance: Compliant; Price: None; Value: *
Y1 = CRYSTAL: PART_NO.: NX3225SA-26.000000MHZ-G4

## Sheet NvideaJetsonUSBPage2.SchDoc
size A3
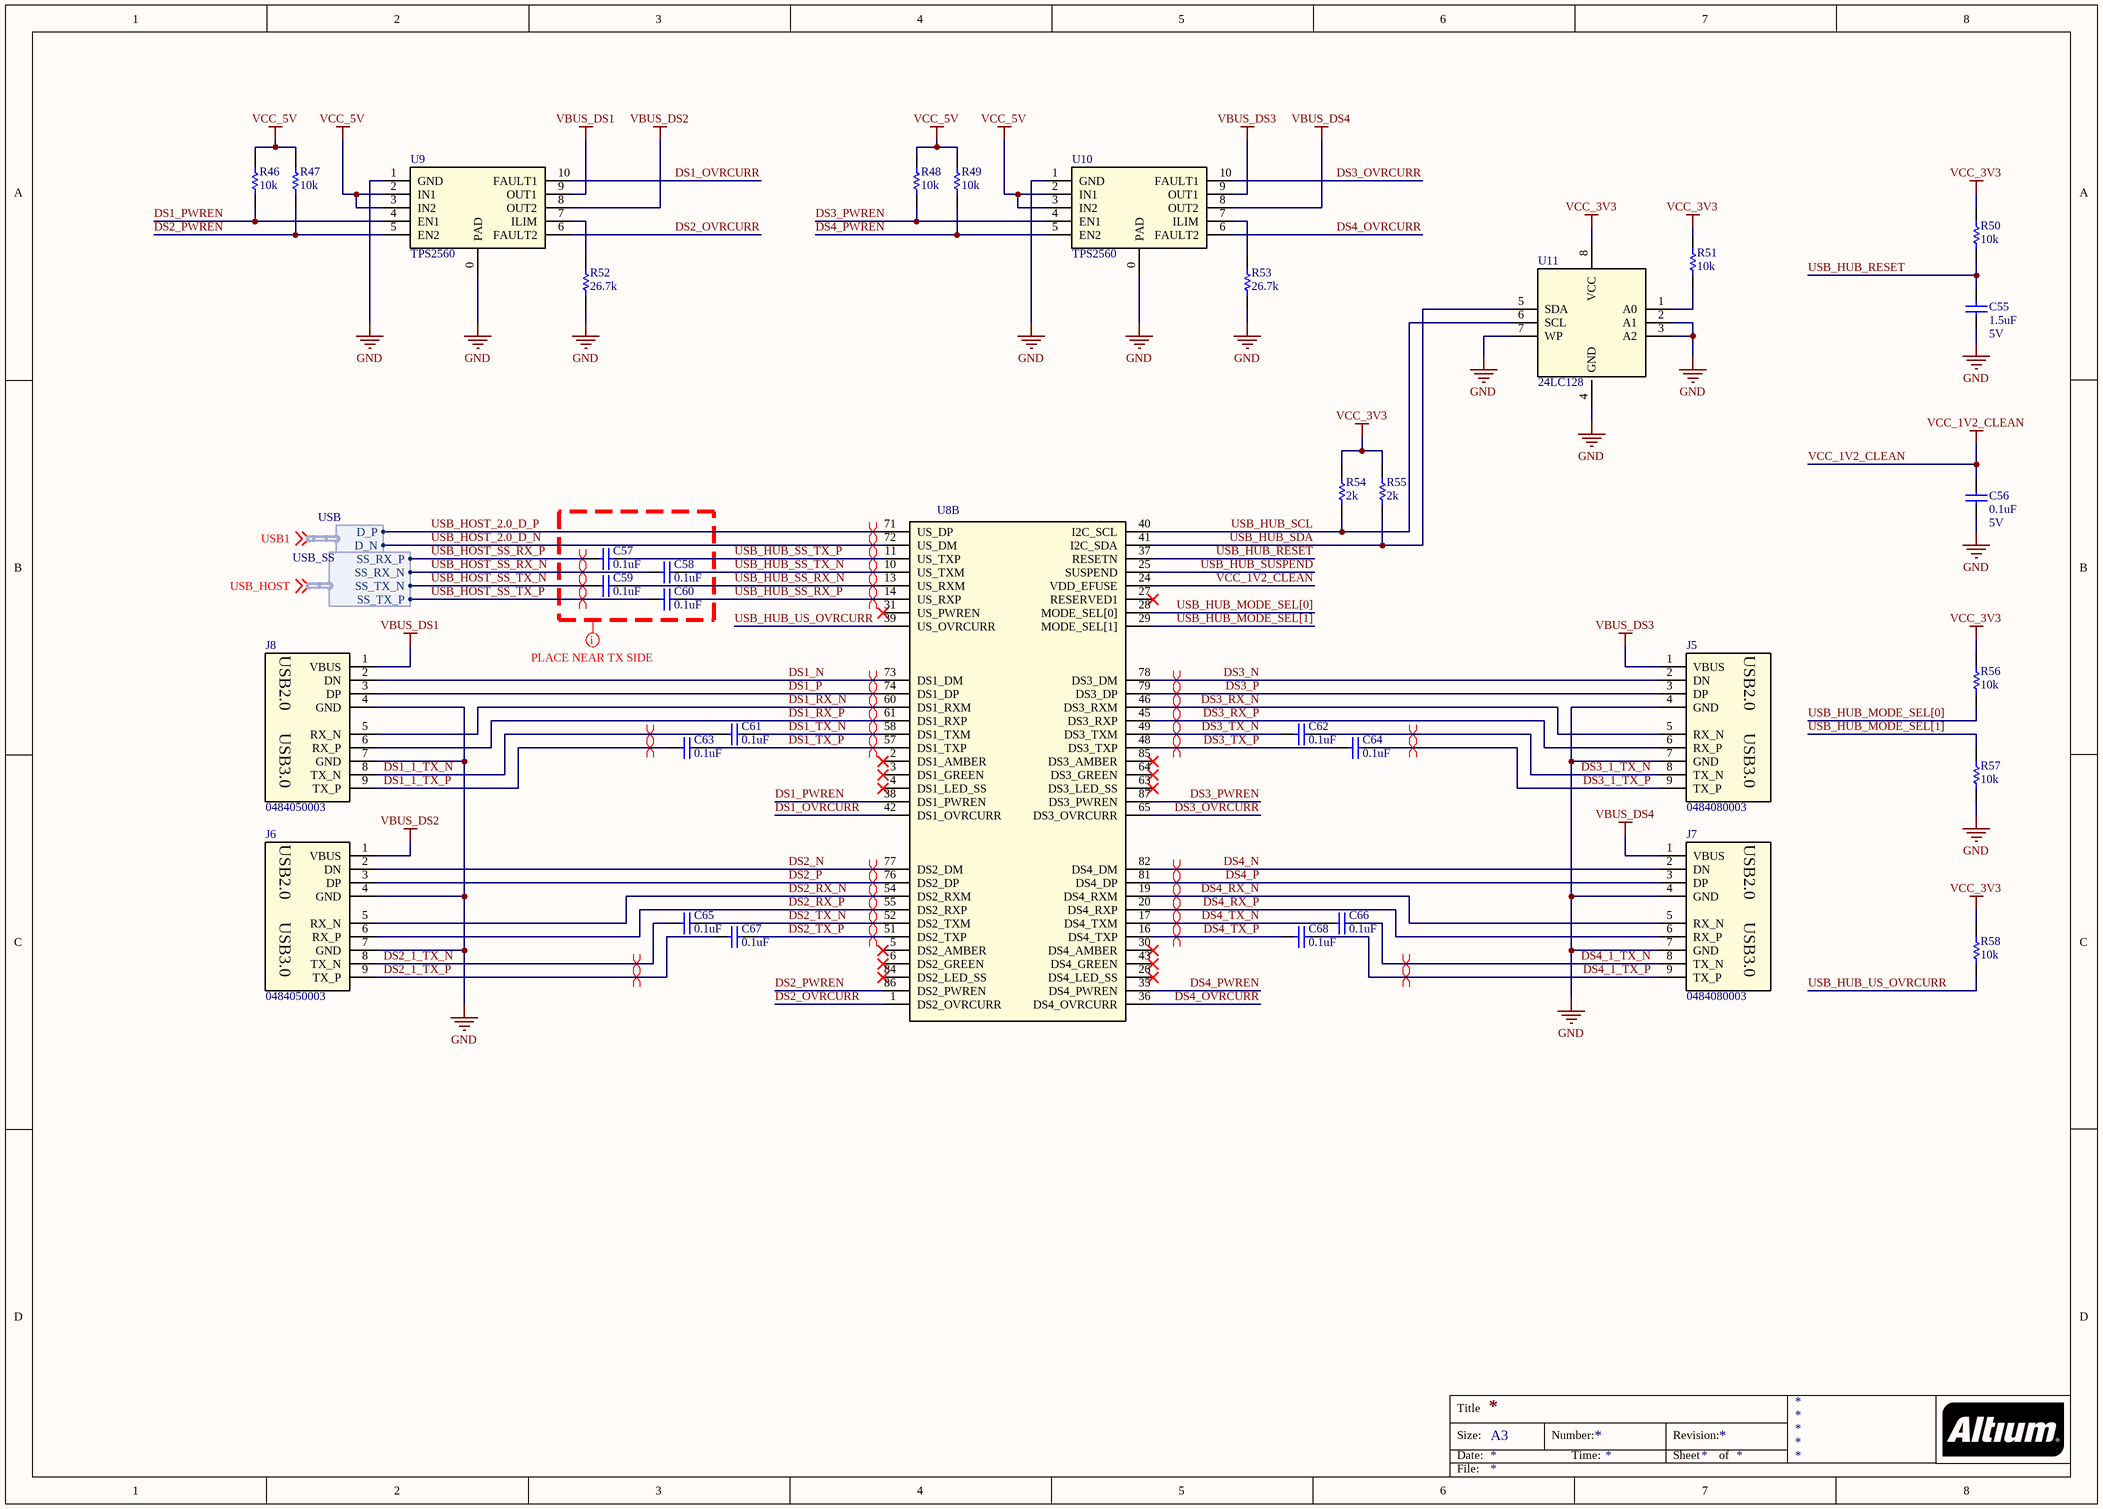
[diagram p4: NvideaJetsonUSBPage2.SchDoc]

### Parts
C55  value 1.5uF  Voltage: 5V  [C0402]  (hidden comment: CAP)
C56  value 0.1uF  Voltage: 5V  [C0402]  (hidden comment: CAP)
C57  value 0.1uF  [C0402]  (hidden comment: CAP)
C58  value 0.1uF  [C0402]  (hidden comment: CAP)
C59  value 0.1uF  [C0402]  (hidden comment: CAP)
C60  value 0.1uF  [C0402]  (hidden comment: CAP)
C61  value 0.1uF  [C0402]  (hidden comment: CAP)
C62  value 0.1uF  [C0402]  (hidden comment: CAP)
C63  value 0.1uF  [C0402]  (hidden comment: CAP)
C64  value 0.1uF  [C0402]  (hidden comment: CAP)
C65  value 0.1uF  [C0402]  (hidden comment: CAP)
C66  value 0.1uF  [C0402]  (hidden comment: CAP)
C67  value 0.1uF  [C0402]  (hidden comment: CAP)
C68  value 0.1uF  [C0402]  (hidden comment: CAP)
J5  0484080003  [0484080003]
J6  0484050003  [0484050003]
J7  0484080003  [0484080003]
J8  0484050003  [0484050003]
R46  value 10k  [R0402]  (hidden comment: RES)
R47  value 10k  [R0402]  (hidden comment: RES)
R48  value 10k  [R0402]  (hidden comment: RES)
R49  value 10k  [R0402]  (hidden comment: RES)
R50  value 10k  [R0402]  (hidden comment: RES)
R51  value 10k  [R0402]  (hidden comment: RES)
R52  value 26.7k  [R0402]  (hidden comment: RES)
R53  value 26.7k  [R0402]  (hidden comment: RES)
R54  value 2k  [R0402]  (hidden comment: RES)
R55  value 2k  [R0402]  (hidden comment: RES)
R56  value 10k  [R0402]  (hidden comment: RES)
R57  value 10k  [R0402]  (hidden comment: RES)
R58  value 10k  [R0402]  (hidden comment: RES)
U8  CYUSB3312-88LTXC  [QFN88]  (value not drawn)  (part B of 2)
U9  TPS2560  [VSON10]
U10  TPS2560  [VSON10]
U11  24LC128  [24LC128T-I/SN]

### Harnesses
USB_SS: SS_RX_P, SS_RX_N, SS_TX_N, SS_TX_P
USB: D_N, D_P

### Nets
GND: C55.2 C56.2 J5.4(GND) J5.7(GND) J6.4(GND) J6.7(GND) J7.4(GND) J7.7(GND) J8.4(GND) J8.7(GND) R52.2 R53.2 R57.2 U9.0(PAD) U9.1(GND) U10.0(PAD) U10.1(GND) U11.2(A1) U11.3(A2) U11.4(GND) U11.7(WP)
VBUS_DS1: J8.1(VBUS) U9.9(OUT1)
VBUS_DS2: J6.1(VBUS) U9.8(OUT2)
VBUS_DS3: J5.1(VBUS) U10.9(OUT1)
VBUS_DS4: J7.1(VBUS) U10.8(OUT2)
VCC_1V2_CLEAN: C56.1 U8.24(VDD_EFUSE)
VCC_3V3: R50.1 R51.1 R54.1 R55.1 R56.1 R58.1 U11.8(VCC)
VCC_5V: R46.1 R47.1 R48.1 R49.1 U9.2(IN1) U9.3(IN2) U10.2(IN1) U10.3(IN2)
DS1_1_TX_N: C61.1 J8.8(TX_N)
DS1_1_TX_P: C63.1 J8.9(TX_P)
DS1_N: J8.2(DN) U8.73(DS1_DM)
DS1_OVRCURR: U8.42(DS1_OVRCURR) U9.10(FAULT1)
DS1_P: J8.3(DP) U8.74(DS1_DP)
DS1_PWREN: R46.2 U8.38(DS1_PWREN) U9.4(EN1)
DS1_RX_N: J8.5(RX_N) U8.60(DS1_RXM)
DS1_RX_P: J8.6(RX_P) U8.61(DS1_RXP)
DS1_TX_N: C61.2 U8.58(DS1_TXM)
DS1_TX_P: C63.2 U8.57(DS1_TXP)
DS2_1_TX_N: C65.1 J6.8(TX_N)
DS2_1_TX_P: C67.1 J6.9(TX_P)
DS2_N: J6.2(DN) U8.77(DS2_DM)
DS2_OVRCURR: U8.1(DS2_OVRCURR) U9.6(FAULT2)
DS2_P: J6.3(DP) U8.76(DS2_DP)
DS2_PWREN: R47.2 U8.86(DS2_PWREN) U9.5(EN2)
DS2_RX_N: J6.5(RX_N) U8.54(DS2_RXM)
DS2_RX_P: J6.6(RX_P) U8.55(DS2_RXP)
DS2_TX_N: C65.2 U8.52(DS2_TXM)
DS2_TX_P: C67.2 U8.51(DS2_TXP)
DS3_1_TX_N: C62.2 J5.8(TX_N)
DS3_1_TX_P: C64.2 J5.9(TX_P)
DS3_N: J5.2(DN) U8.78(DS3_DM)
DS3_OVRCURR: U8.65(DS3_OVRCURR) U10.10(FAULT1)
DS3_P: J5.3(DP) U8.79(DS3_DP)
DS3_PWREN: R48.2 U8.87(DS3_PWREN) U10.4(EN1)
DS3_RX_N: J5.5(RX_N) U8.46(DS3_RXM)
DS3_RX_P: J5.6(RX_P) U8.45(DS3_RXP)
DS3_TX_N: C62.1 U8.49(DS3_TXM)
DS3_TX_P: C64.1 U8.48(DS3_TXP)
DS4_1_TX_N: C66.2 J7.8(TX_N)
DS4_1_TX_P: C68.2 J7.9(TX_P)
DS4_N: J7.2(DN) U8.82(DS4_DM)
DS4_OVRCURR: U8.36(DS4_OVRCURR) U10.6(FAULT2)
DS4_P: J7.3(DP) U8.81(DS4_DP)
DS4_PWREN: R49.2 U8.35(DS4_PWREN) U10.5(EN2)
DS4_RX_N: J7.5(RX_N) U8.19(DS4_RXM)
DS4_RX_P: J7.6(RX_P) U8.20(DS4_RXP)
DS4_TX_N: C66.1 U8.17(DS4_TXM)
DS4_TX_P: C68.1 U8.16(DS4_TXP)
USB_HOST_2.0_D_N: U8.72(US_DM) ; harness USB.D_N
USB_HOST_2.0_D_P: U8.71(US_DP) ; harness USB.D_P
USB_HOST_SS_RX_N: C58.1 ; harness USB_SS.SS_RX_N
USB_HOST_SS_RX_P: C57.1 ; harness USB_SS.SS_RX_P
USB_HOST_SS_TX_N: C59.1 ; harness USB_SS.SS_TX_N
USB_HOST_SS_TX_P: C60.1 ; harness USB_SS.SS_TX_P
USB_HUB_MODE_SEL[0]: R56.2 U8.28(MODE_SEL[0])
USB_HUB_MODE_SEL[1]: R57.1 U8.29(MODE_SEL[1])
USB_HUB_RESET: C55.1 R50.2 U8.37(RESETN)
USB_HUB_SCL: R54.2 U8.40(I2C_SCL) U11.6(SCL)
USB_HUB_SDA: R55.2 U8.41(I2C_SDA) U11.5(SDA)
USB_HUB_SS_RX_N: C59.2 U8.13(US_RXM)
USB_HUB_SS_RX_P: C60.2 U8.14(US_RXP)
USB_HUB_SS_TX_N: C58.2 U8.10(US_TXM)
USB_HUB_SS_TX_P: C57.2 U8.11(US_TXP)
USB_HUB_SUSPEND: U8.25(SUSPEND)
USB_HUB_US_OVRCURR: R58.2 U8.39(US_OVRCURR)
NetR51_2: R51.2 U11.1(A0)
NetR52_1: R52.1 U9.7(ILIM)
NetR53_1: R53.1 U10.7(ILIM)

Not connected (* = marked no-connect by the designer): U8 2(DS1_AMBER)* 3(DS1_GREEN)* 4(DS1_LED_SS)* 5(DS2_AMBER)* 6(DS2_GREEN)* 26(DS4_LED_SS)* 27(RESERVED1)* 30(DS4_AMBER)* 31(US_PWREN)* 43(DS4_GREEN)* 63(DS3_LED_SS)* 64(DS3_GREEN)* 84(DS2_LED_SS)* 85(DS3_AMBER)*

### Layout directives
mark named PLACE NEAR TX SIDE: (no net found under the mark)
differential pair; differential pair class DIFF; net class USB: DS1_1_TX_N, DS1_1_TX_P, DS1_N, DS1_P, DS1_RX_N, DS1_RX_P, DS1_TX_N, DS1_TX_P, DS2_1_TX_N, DS2_1_TX_P, DS2_N, DS2_P, DS2_RX_N, DS2_RX_P, DS2_TX_N, DS2_TX_P, DS3_1_TX_N, DS3_1_TX_P, DS3_N, DS3_P, DS3_RX_N, DS3_RX_P, DS3_TX_N, DS3_TX_P, DS4_1_TX_N, DS4_1_TX_P, DS4_N, DS4_P, DS4_RX_N, DS4_RX_P, DS4_TX_N, DS4_TX_P, USB_HOST_2.0_D_N, USB_HOST_2.0_D_P, USB_HOST_SS_RX_N, USB_HOST_SS_RX_P, USB_HOST_SS_TX_N, USB_HOST_SS_TX_P, USB_HUB_SS_RX_N, USB_HUB_SS_RX_P, USB_HUB_SS_TX_N, USB_HUB_SS_TX_P

### Notes on the sheet
- Labels drawn without touching a wire or pin: USB1, USB_HOST
- Title
- Size:
- Date:
- A3
- Number:
- Time:
- Revision:
- Sheet
- of
- File:
- (in symbol 0484050003) USB2.0; USB3.0
- (in symbol 0484080003) USB2.0; USB3.0

### Library data of the parts
C55-C68 = CAP: =Description
J5 J7 = 0484080003: USB3.0 Recepticle Vertical
J6 J8 = 0484050003: USB3.0 Recepticle Right Angle
R46-R58 = RES: =Description
U8 = CYUSB3312-88LTXC: as U8 on sheet NvideaJetsonUSB; SnapEDA_Link: https://www.snapeda.com/parts/2309411-2/TE%20Connectivity/view-part/?ref=snap; TE_purchase_URL: https://www.te.com/usa-en/product-2309411-2.html?te_bu=Cor&te_type=disp&te_campaign=seda_glo_cor-seda-global-disp-prtnr-fy19-seda-model-bom-cta_sma-317_1&elqCampaignId=32493; Package: None; EU_RoHS_Compliance: Compliant; Price: None; Value: *
U9 U10 = TPS2560: IC PWR SWITCH N-CHAN 1:2 10VSON
U11 = 24LC128: IC EEPROM 128K I2C 400KHZ

## Nets that join several sheets
GND: NvideaJetsonNano (70 pins), NvideaJetsonPeripherals (31 pins), PowerSupply (17 pins), NvideaJetsonUSB (33 pins), NvideaJetsonUSBPage2 (21 pins)
VCC_1V2_CLEAN: NvideaJetsonUSB (7 pins), NvideaJetsonUSBPage2 (C56.1 U8.24)
VCC_1V8: NvideaJetsonPeripherals (R26.1), PowerSupply (C22.1 L4.2 R36.1)
VCC_3V3: NvideaJetsonPeripherals (C23.2 J4.22 U1.1), PowerSupply (C19.1 L3.2 R32.1), NvideaJetsonUSB (14 pins), NvideaJetsonUSBPage2 (7 pins)
VCC_5V: NvideaJetsonNano (12 pins), NvideaJetsonPeripherals (C24.2 U2.1), PowerSupply (5 pins), NvideaJetsonUSB (U8.23), NvideaJetsonUSBPage2 (8 pins)
HDMI_CEC_3V3: NvideaJetsonNano (J1.94), NvideaJetsonPeripherals (D1.1 Q5.2 R24.2)
HDMI_HPD_1V8: NvideaJetsonNano (J1.96), NvideaJetsonPeripherals (Q6.3 R26.2)
HDMI_SCL: NvideaJetsonNano (J1.100), NvideaJetsonPeripherals (Q3.2 R22.2)
HDMI_SDA: NvideaJetsonNano (J1.98), NvideaJetsonPeripherals (Q4.2 R23.2)
MOD_SLEEP: NvideaJetsonNano (J1.178), NvideaJetsonPeripherals (R9.1 U1.3)
USB0_VBUS_DET: NvideaJetsonNano (J1.87), NvideaJetsonPeripherals (Q1.3)